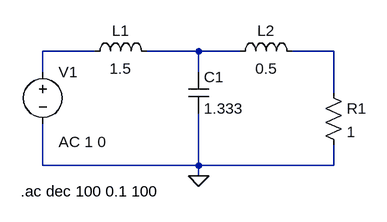
[diagram p0: schematic TS8.asc]
TS8.asc, the LTspice schematic file:
Version 4
SHEET 1 880 680
WIRE 144 112 64 112
WIRE 304 112 224 112
WIRE 368 112 304 112
WIRE 512 112 448 112
WIRE 64 144 64 112
WIRE 304 144 304 112
WIRE 512 176 512 112
WIRE 64 288 64 224
WIRE 304 288 304 208
WIRE 304 288 64 288
WIRE 512 288 512 256
WIRE 512 288 304 288
WIRE 304 304 304 288
FLAG 304 304 0
SYMBOL voltage 64 128 R0
WINDOW 123 24 124 Left 2
WINDOW 39 0 0 Left 0
SYMATTR InstName V1
SYMATTR Value ""
SYMATTR Value2 AC 1 0
SYMBOL ind 128 128 R270
WINDOW 0 32 56 VTop 2
WINDOW 3 5 56 VBottom 2
SYMATTR InstName L1
SYMATTR Value 1.5
SYMBOL cap 288 144 R0
SYMATTR InstName C1
SYMATTR Value 1.333
SYMBOL ind 352 128 R270
WINDOW 0 32 56 VTop 2
WINDOW 3 5 56 VBottom 2
SYMATTR InstName L2
SYMATTR Value 0.5
SYMBOL res 496 160 R0
SYMATTR InstName R1
SYMATTR Value 1
TEXT 30 328 Left 2 !.ac dec 100 0.1 100

The netlist it stands for:
* TS8.asc
V1 N001 0 AC 1 0
L1 N001 N002 1.5
C1 N002 0 1.333
L2 N002 N003 0.5
R1 N003 0 1
.ac dec 100 0.1 100
.backanno
.end